# Altium schematic sheet Power_Supply.SchDoc
size B; SheetNumber: 11; SheetTotal: 15
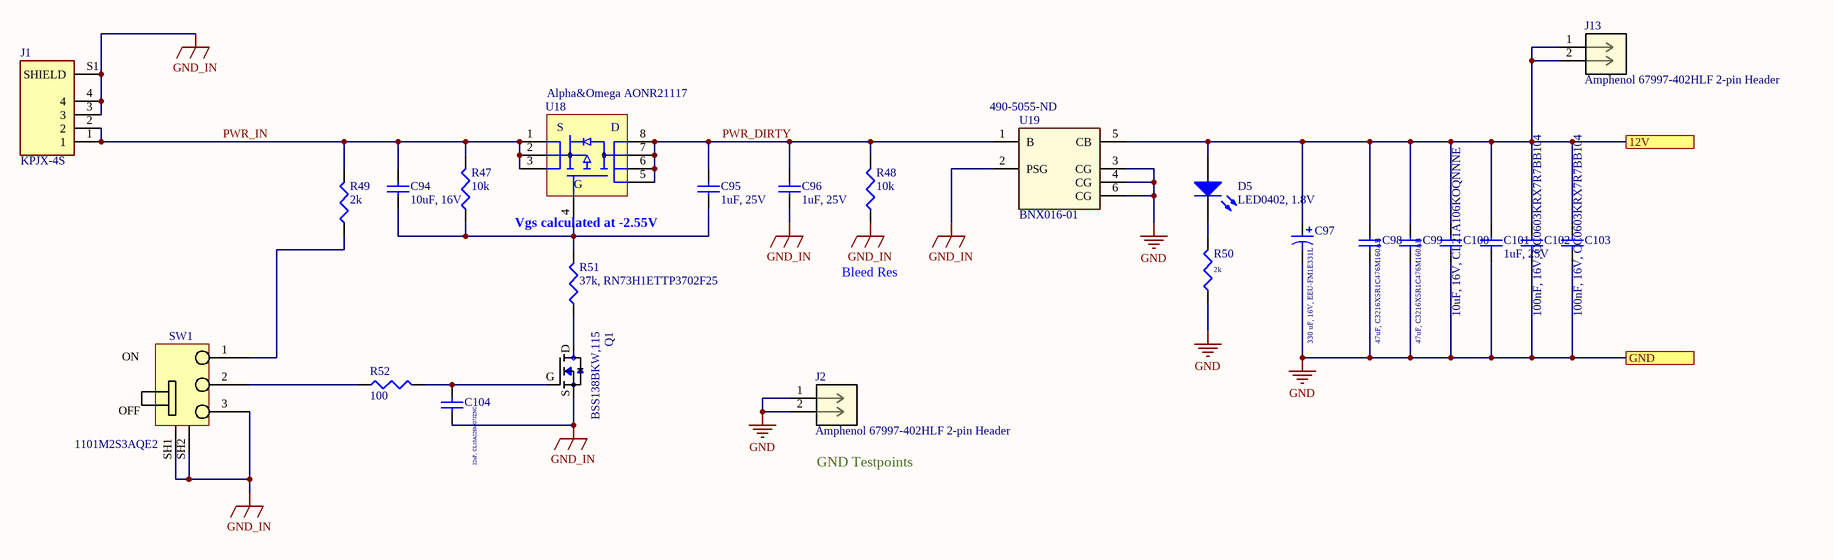
[diagram p0: Power_Supply.SchDoc]

## Parts
C94  10uF, 16V  [SMD-0603]
C95  1uF, 25V  [SMD-0603]
C96  1uF, 25V  [SMD-0603]
C97  330 uF, 16V, EEU-FM1E331L  [CAP-AXIAL-8.0-3.5]
C98  47uF, C3216X5R1C476M160AB  [SMD-1206]
C99  47uF, C3216X5R1C476M160AB  [SMD-1206]
C100  10uF, 16V, CL21A106KOQNNNE  [SMD-0805]
C101  1uF, 25V  [SMD-0603]
C102  100nF, 16V, CC0603KRX7R7BB104  [SMD-0603]
C103  100nF, 16V, CC0603KRX7R7BB104  [SMD-0603]
C104  22uF, CL10A226MO7JZNC  [SMD-0603]
D5  LED0402, 1.8V  [LED-0402]
J1  KPJX-4S  [KYCON_KPJX-4S]
J2  Amphenol 67997-402HLF 2-pin Header  [Amphenol  67997-402HLF 2-pin header]
J13  Amphenol 67997-402HLF 2-pin Header  [Amphenol  67997-402HLF 2-pin header]
Q1  BSS138BKW,115  [BSS138BKW,115]
R47  10k  [SMD-0402]
R48  10k  [SMD-0402]
R49  2k  [SMD-0402]
R50  2k  [SMD-0402]
R51  37k, RN73H1ETTP3702F25  [SMD-0402]
R52  100  [SMD-0402]
SW1  1101M2S3AQE2  [1101M2S3ABE2]
U18  Alpha&Omega AONR21117  [Alpha&Omega_AONR21321]
U19  BNX016-01  Supplier Part Number 1: 490-5055-ND  [FIL_BNX016-01]

## Ports
12V (see Main[2C]), GND (see Main[2C], 3V7_to_3V3_LDO[1B], 5V5_to_5V0_LDO[1C], Buck_TPSM82913_1V8[3C], Buck_TPSM82913_3V7[3C], Buck_TPSM82913_5V0[3C], Buck_TPSM82913_5V5[2C], Clocking_and_LO[2A], Fan_Interfaces[2B], IQ_Demod[1C], IQ_Mod[1B], LMX2820[4D], Microzed_Interfaces[1A], Voltage_Conv_Bidirectional[1B])

## Nets
GND: C97.2 C98.1 C99.1 C100.1 C101.1 C102.1 C103.1 J2.1 J2.2 R50.1 U19.3(CG) U19.4(CG) U19.6(CG) ; port GND
GND_IN: C96.1 C104.1 J1.3 J1.4 J1.S1(SHIELD) Q1.S R48.1 SW1.3 SW1.SH1 SW1.SH2 U19.2(PSG)
12V: C97.1 C98.2 C99.2 C100.2 C101.2 C102.2 C103.2 D5.1(A) J13.1 J13.2 U19.5(CB) ; port 12V
PWR_DIRTY: C95.2 C96.2 R48.2 U18.5 U18.6 U18.7 U18.8 U19.1(B)
PWR_IN: C94.2 J1.1 J1.2 R47.2 R49.2 U18.1 U18.2 U18.3
NetC94_1: C94.1 C95.1 R47.1 R51.2 U18.4
NetC104_2: C104.2 Q1.G R52.2
NetD5_2: D5.2(K) R50.2
NetQ1_D: Q1.D R51.1
NetR49_1: R49.1 SW1.1
NetR52_1: R52.1 SW1.2

## Notes on the sheet
- Vgs calculated at -2.55V
- Bleed Res
- (near J2) GND Testpoints
- (in symbol 11-1M2S3AQE2) ON; OFF
- (in symbol Alpha&Omega AONR21117) S; D; G

## Library data of the parts
C94 C102-C104 = CAP0603: Ceramic Capacitor 0603
C95 C96 C101 = CAP0603_HV: Ceramic Capacitor 0603, 25V
C97 = CAP_ELECTRO: CAP ALUM 330UF 20% 25V RADIAL EEU-FM1E331
C98 C99 = CAP1206: Ceramic Capacitor 1206 Imperial
C100 = CAP0805: Ceramic Capacitor 0805 Imperial (2012 Metric)
D5 = LED0402: LED 0402
J1 = KPJX-4S: 4 _Power_ Position Circular Connector Jack, Female Sockets Solder; MF: Kycon; Value: *; Package: DIP-20 Kycon; Price: None; MP: KPJX-4S; Availability: Unavailable; SnapEDA_Link: https://www.snapeda.com/parts/KPJX-4S/Kycon/view-part/555404/?ref=snap
J2 J13 = Amphenol 67997-402HLF 2-pin Header: No Description Available; Mfr_Name: Amphenol ICC; RefDes: RefDes; Type: Type
Q1 = BSS138: N-Channel Logic Level Enhancement Mode Field Effect Transistor; MF: MICROSS/On Semiconductor; MP: BSS138; Price: None; Availability: Unavailable; Package: TO-236-3 Micross; SnapEDA_Link: https://www.snapeda.com/parts/BSS138/MICROSS/On%20Semiconductor/view-part/?ref=snap; Value: *
R47-R52 = RES0402: Resistor-0402
SW1 = 11-1M2S3AQE2: SPDT, RIGHT ANGLE, PC THRU-HOLE; pin to pad: SH1>4 SH2>5
U18 = Alpha&Omega AONR21117: P-Channel 20-V (D-S) MOSFET
U19 = BNX016-01: Filter: anti-interference; wideband; Mounting: THT; 15A; -40Ã·125Â°; MF: Murata Electronics; MP: BNX016-01; Digi-Key_Purchase_URL: https://www.digikey.com/product-detail/en/murata-electronics/BNX016-01/490-5055-ND/1825576?utm_source=snapeda&utm_medium=aggregator&utm_campaign=symbol; Package: Block-4 Murata; SnapEDA_Link: https://www.snapeda.com/parts/BNX016-01/Murata%20Electronics%20North%20America/view-part/?ref=snap; Digi-Key_Part_Number: 490-5055-ND; Value: *; Supplier 1: Digi-Key